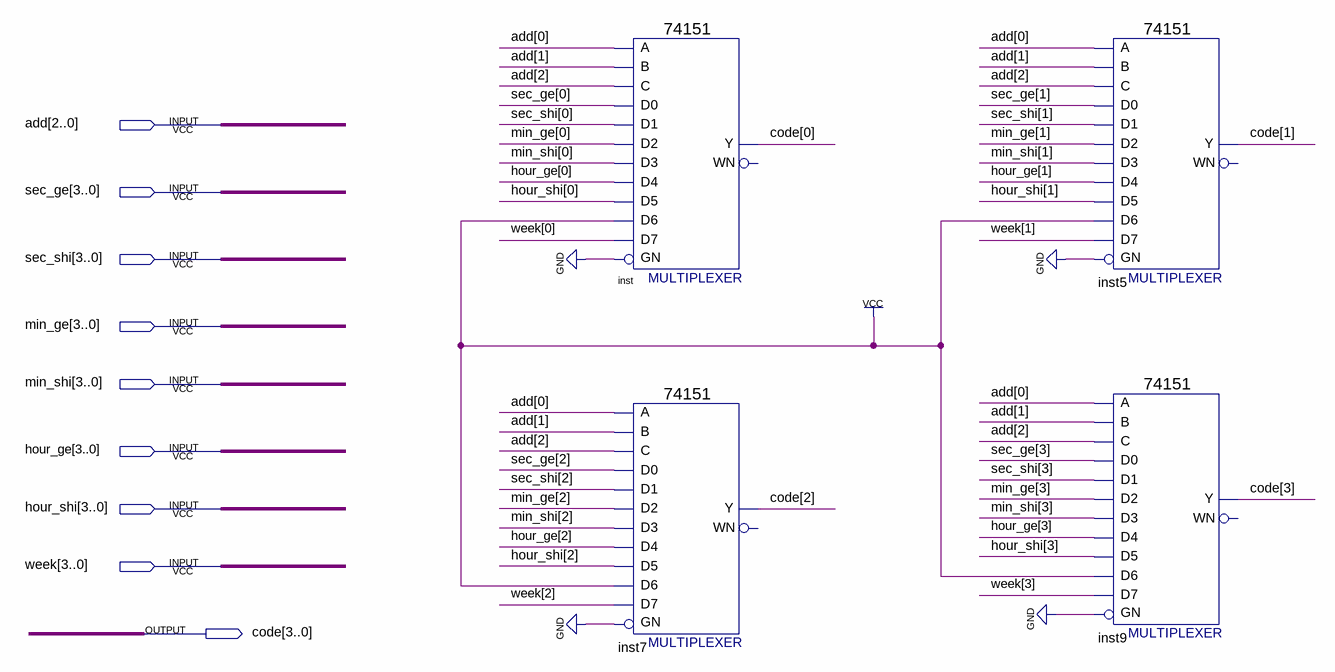
[diagram p0: schematic sheet]
// Quartus schematic sec_select.bdf as structural Verilog: 4 symbols, 9 pins
module sec_select (
  input  [2:0] add,
  input  [3:0] sec_ge,
  input  [3:0] sec_shi,
  input  [3:0] min_ge,
  input  [3:0] min_shi,
  input  [3:0] hour_ge,
  input  [3:0] hour_shi,
  input  [3:0] week,
  output [3:0] code
);

  \74151  inst (
    .GN(1'b0), .C(add[2]), .B(add[1]), .A(add[0]), .D5(hour_shi[0]), .D0(sec_ge[0]), .D1(sec_shi[0]),
    .D4(hour_ge[0]), .D3(min_shi[0]), .D2(min_ge[0]), .D6(1'b1), .D7(week[0]), .Y(code[0]));  // open: WN
  \74151  inst7 (
    .GN(1'b0), .C(add[2]), .B(add[1]), .A(add[0]), .D5(hour_shi[2]), .D0(sec_ge[2]), .D1(sec_shi[2]),
    .D4(hour_ge[2]), .D3(min_shi[2]), .D2(min_ge[2]), .D6(1'b1), .D7(week[2]), .Y(code[2]));  // open: WN
  \74151  inst5 (
    .GN(1'b0), .C(add[2]), .B(add[1]), .A(add[0]), .D5(hour_shi[1]), .D0(sec_ge[1]), .D1(sec_shi[1]),
    .D4(hour_ge[1]), .D3(min_shi[1]), .D2(min_ge[1]), .D6(1'b1), .D7(week[1]), .Y(code[1]));  // open: WN
  \74151  inst9 (
    .GN(1'b0), .C(add[2]), .B(add[1]), .A(add[0]), .D5(hour_shi[3]), .D0(sec_ge[3]), .D1(sec_shi[3]),
    .D4(hour_ge[3]), .D3(min_shi[3]), .D2(min_ge[3]), .D6(1'b1), .D7(week[3]), .Y(code[3]));  // open: WN
endmodule
